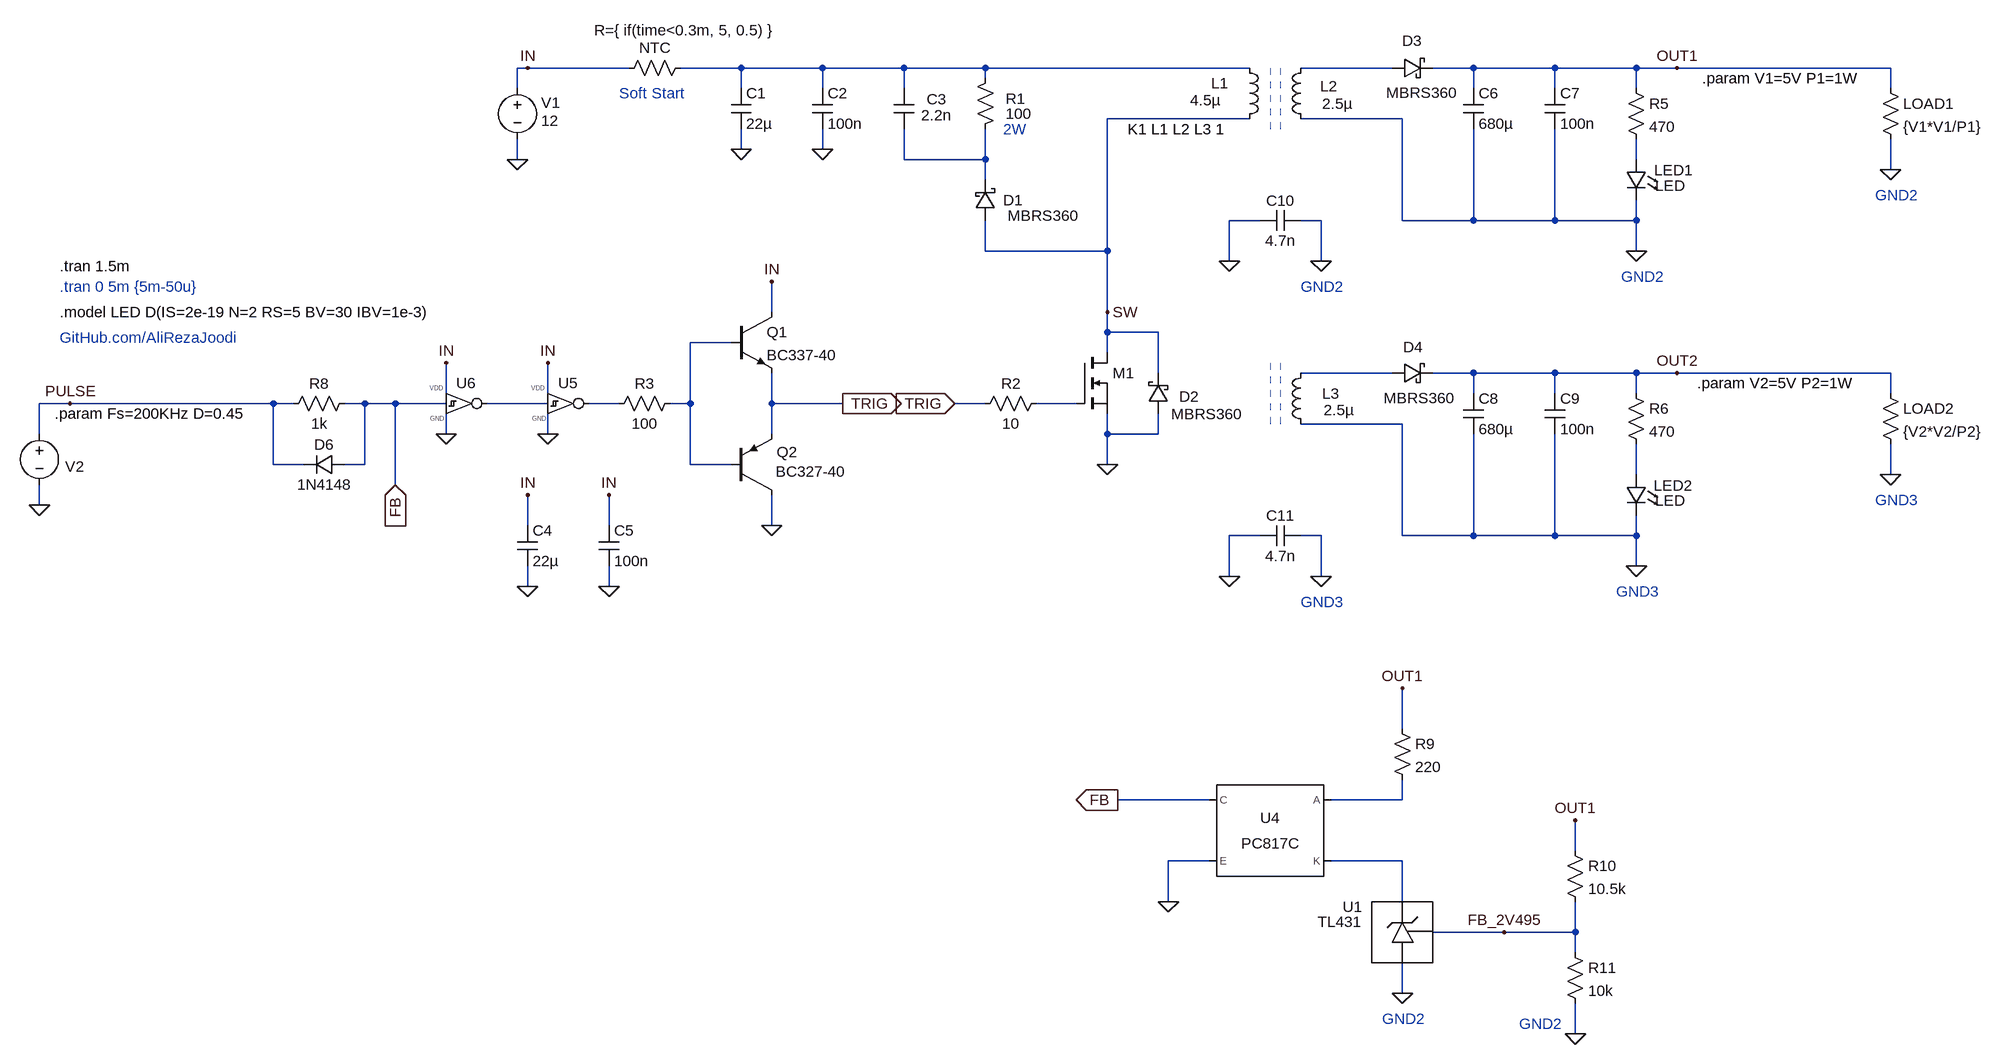
[diagram p0: schematic v2.0.asc]
v2.0.asc, the LTspice schematic file:
Version 4.1
SHEET 1 2628 1988
WIRE 304 192 288 192
WIRE 464 192 304 192
WIRE 640 192 544 192
WIRE 768 192 640 192
WIRE 896 192 768 192
WIRE 1024 192 896 192
WIRE 1440 192 1024 192
WIRE 1664 192 1520 192
WIRE 1792 192 1728 192
WIRE 1920 192 1792 192
WIRE 2048 192 1920 192
WIRE 2112 192 2048 192
WIRE 2448 192 2112 192
WIRE 1024 208 1024 192
WIRE 288 224 288 192
WIRE 640 224 640 192
WIRE 768 224 768 192
WIRE 896 224 896 192
WIRE 1792 224 1792 192
WIRE 1920 224 1920 192
WIRE 2048 224 2048 192
WIRE 2448 224 2448 192
WIRE 1440 272 1216 272
WIRE 1680 272 1520 272
WIRE 640 320 640 288
WIRE 768 320 768 288
WIRE 288 336 288 304
WIRE 896 336 896 288
WIRE 1024 336 1024 288
WIRE 1024 336 896 336
WIRE 2048 336 2048 304
WIRE 2448 352 2448 304
WIRE 1024 368 1024 336
WIRE 1456 432 1408 432
WIRE 1552 432 1520 432
WIRE 1680 432 1680 272
WIRE 1792 432 1792 288
WIRE 1792 432 1680 432
WIRE 1920 432 1920 288
WIRE 1920 432 1792 432
WIRE 2048 432 2048 400
WIRE 2048 432 1920 432
WIRE 1024 480 1024 432
WIRE 1216 480 1216 272
WIRE 1216 480 1024 480
WIRE 2048 480 2048 432
WIRE 1408 496 1408 432
WIRE 1552 496 1552 432
WIRE 688 576 688 528
WIRE 1216 576 1216 480
WIRE 1216 608 1216 576
WIRE 1296 608 1216 608
WIRE 624 624 560 624
WIRE 1216 640 1216 608
WIRE 1296 672 1296 608
WIRE 1664 672 1520 672
WIRE 1792 672 1728 672
WIRE 1920 672 1792 672
WIRE 2048 672 1920 672
WIRE 2112 672 2048 672
WIRE 2448 672 2112 672
WIRE 176 704 176 656
WIRE 336 704 336 656
WIRE 1792 704 1792 672
WIRE 1920 704 1920 672
WIRE 2048 704 2048 672
WIRE 2448 704 2448 672
WIRE -416 720 -464 720
WIRE -96 720 -416 720
WIRE -64 720 -96 720
WIRE 48 720 16 720
WIRE 96 720 48 720
WIRE 176 720 96 720
WIRE 336 720 240 720
WIRE 448 720 400 720
WIRE 560 720 560 624
WIRE 560 720 528 720
WIRE 688 720 688 672
WIRE 800 720 688 720
WIRE 1024 720 976 720
WIRE 1168 720 1104 720
WIRE 1680 752 1520 752
WIRE -464 768 -464 720
WIRE 176 768 176 736
WIRE 336 768 336 736
WIRE 688 768 688 720
WIRE 1216 768 1216 736
WIRE 1296 768 1296 736
WIRE 1296 768 1216 768
WIRE -96 816 -96 720
WIRE -48 816 -96 816
WIRE 48 816 48 720
WIRE 48 816 16 816
WIRE 560 816 560 720
WIRE 624 816 560 816
WIRE 1216 816 1216 768
WIRE 2048 832 2048 784
WIRE 2448 832 2448 784
WIRE 96 848 96 720
WIRE -464 880 -464 848
WIRE 304 912 304 864
WIRE 432 912 432 864
WIRE 688 912 688 864
WIRE 1456 928 1408 928
WIRE 1552 928 1520 928
WIRE 1680 928 1680 752
WIRE 1792 928 1792 768
WIRE 1792 928 1680 928
WIRE 1920 928 1920 768
WIRE 1920 928 1792 928
WIRE 2048 928 2048 896
WIRE 2048 928 1920 928
WIRE 2048 976 2048 928
WIRE 1408 992 1408 928
WIRE 1552 992 1552 928
WIRE 304 1008 304 976
WIRE 432 1008 432 976
WIRE 1680 1232 1680 1168
WIRE 1376 1344 1232 1344
WIRE 1680 1344 1680 1312
WIRE 1680 1344 1568 1344
WIRE 1952 1424 1952 1376
WIRE 1376 1440 1312 1440
WIRE 1680 1440 1568 1440
WIRE 1312 1504 1312 1440
WIRE 1680 1504 1680 1440
WIRE 1840 1552 1728 1552
WIRE 1952 1552 1952 1504
WIRE 1952 1552 1840 1552
WIRE 1952 1584 1952 1552
WIRE 1680 1648 1680 1600
WIRE 1952 1712 1952 1664
FLAG 288 336 0
FLAG -464 880 0
FLAG -416 720 PULSE
FLAG 1216 816 0
FLAG 640 320 0
FLAG 768 320 0
FLAG 2048 976 0
FLAG 2112 672 OUT2
FLAG 304 192 IN
FLAG 688 528 IN
FLAG 688 912 0
FLAG 176 768 0
FLAG 176 656 IN
FLAG 336 768 0
FLAG 336 656 IN
FLAG 304 864 IN
FLAG 304 1008 0
FLAG 432 1008 0
FLAG 2048 480 0
FLAG 2112 192 OUT1
FLAG 432 864 IN
FLAG 2448 832 0
FLAG 2448 352 0
FLAG 1216 576 SW
FLAG 1680 1648 0
FLAG 1952 1712 0
FLAG 1952 1376 OUT1
FLAG 1312 1504 0
FLAG 976 720 TRIG
IOPIN 976 720 In
FLAG 800 720 TRIG
IOPIN 800 720 Out
FLAG 1680 1168 OUT1
FLAG 1840 1552 FB_2V495
FLAG 1232 1344 FB
IOPIN 1232 1344 Out
FLAG 96 848 FB
IOPIN 96 848 In
FLAG 1552 496 0
FLAG 1408 496 0
FLAG 1552 992 0
FLAG 1408 992 0
SYMBOL voltage 288 208 R0
WINDOW 123 0 0 Left 0
WINDOW 39 24 105 Left 2
WINDOW 0 37 39 Left 2
WINDOW 3 37 67 Left 2
SYMATTR InstName V1
SYMATTR Value 12
SYMBOL voltage -464 752 R0
WINDOW 123 0 0 Left 0
WINDOW 39 0 0 Left 0
WINDOW 0 41 67 Left 2
WINDOW 3 -361 80 Invisible 2
SYMATTR InstName V2
SYMATTR Value PULSE(0 9 0 {0.01/Fs} {0.01/Fs} {D/Fs} {1/Fs})
SYMBOL ind 1424 176 R0
WINDOW 0 -45 40 Left 2
WINDOW 3 -78 67 Left 2
SYMATTR InstName L1
SYMATTR Value 4.5µ
SYMATTR SpiceLine Rser=0.057
SYMATTR Type ind
SYMBOL cap 880 288 M180
WINDOW 0 52 47 Left 2
WINDOW 3 43 22 Left 2
SYMATTR InstName C3
SYMATTR Value 2.2n
SYMBOL res 1008 304 M180
WINDOW 0 48 64 Left 2
WINDOW 3 48 40 Left 2
SYMATTR InstName R1
SYMATTR Value 100
SYMATTR SpiceLine pwr=2
SYMBOL nmos 1168 640 R0
WINDOW 3 56 72 Invisible 2
SYMATTR Value BSC100N06LS3
SYMATTR InstName M1
SYMBOL cap 624 224 R0
SYMATTR InstName C1
SYMATTR Value 22µ
SYMBOL schottky 1008 432 M180
WINDOW 0 44 32 Left 2
WINDOW 3 161 8 Right 2
SYMATTR InstName D1
SYMATTR Value MBRS360
SYMBOL cap 752 224 R0
SYMATTR InstName C2
SYMATTR Value 100n
SYMBOL schottky 1312 736 R180
WINDOW 0 -48 27 Left 2
WINDOW 3 -114 -1 Left 2
SYMATTR InstName D2
SYMATTR Value MBRS360
SYMBOL ind 1536 768 R180
WINDOW 0 -45 64 Left 2
WINDOW 3 -20 38 Right 2
SYMATTR InstName L3
SYMATTR Value 2.5µ
SYMATTR SpiceLine Rser=0.011
SYMATTR Type ind
SYMBOL schottky 1664 688 R270
WINDOW 0 41 33 VTop 2
WINDOW 3 -8 41 VBottom 2
SYMATTR InstName D4
SYMATTR Value MBRS360
SYMBOL cap 1776 704 R0
SYMATTR InstName C8
SYMATTR Value 680µ
SYMBOL cap 1904 704 R0
SYMATTR InstName C9
SYMATTR Value 100n
SYMBOL res 2032 688 R0
SYMATTR InstName R6
SYMATTR Value 470
SYMBOL npn 624 576 R0
SYMATTR InstName Q1
SYMATTR Value BC337-40
SYMBOL pnp 624 864 M180
WINDOW 0 72 68 Left 2
WINDOW 3 70 37 Left 2
SYMATTR InstName Q2
SYMATTR Value BC327-40
SYMBOL res 1008 736 R270
WINDOW 0 32 56 VTop 2
WINDOW 3 0 56 VBottom 2
SYMATTR InstName R2
SYMATTR Value 10
SYMBOL res 432 736 R270
WINDOW 0 32 56 VTop 2
WINDOW 3 0 56 VBottom 2
SYMATTR InstName R3
SYMATTR Value 100
SYMBOL res -80 736 R270
WINDOW 0 32 56 VTop 2
WINDOW 3 0 56 VBottom 2
SYMATTR InstName R8
SYMATTR Value 1k
SYMBOL diode 16 800 R90
WINDOW 0 0 32 VBottom 2
WINDOW 3 32 32 VTop 2
SYMATTR InstName D6
SYMATTR Value 1N4148
SYMBOL Optos\\PC817C 1472 1392 M0
SYMATTR InstName U4
SYMBOL cap 288 912 R0
SYMATTR InstName C4
SYMATTR Value 22µ
SYMBOL cap 416 912 R0
SYMATTR InstName C5
SYMATTR Value 100n
SYMBOL ind 1536 288 R180
WINDOW 0 -42 67 Left 2
WINDOW 3 -18 40 Right 2
SYMATTR InstName L2
SYMATTR Value 2.5µ
SYMATTR SpiceLine Rser=0.011
SYMATTR Type ind
SYMBOL schottky 1664 208 R270
WINDOW 0 43 31 VTop 2
WINDOW 3 -7 45 VBottom 2
SYMATTR InstName D3
SYMATTR Value MBRS360
SYMBOL cap 1776 224 R0
SYMATTR InstName C6
SYMATTR Value 680µ
SYMBOL cap 1904 224 R0
SYMATTR InstName C7
SYMATTR Value 100n
SYMBOL res 2032 208 R0
SYMATTR InstName R5
SYMATTR Value 470
SYMBOL res 448 208 R270
WINDOW 0 32 56 VTop 2
WINDOW 3 91 100 VBottom 2
SYMATTR InstName NTC
SYMATTR Value R={ if(time<0.3m, 5, 0.5) }
SYMBOL MyLib\\Digital\\CD40106B 336 688 R0
WINDOW 38 16 64 Invisible 2
SYMATTR InstName U5
SYMATTR SpiceLine vdd=12
SYMBOL MyLib\\Digital\\CD40106B 176 688 R0
WINDOW 38 16 64 Invisible 2
SYMATTR InstName U6
SYMATTR SpiceLine vdd=12
SYMBOL LED 2064 336 M0
WINDOW 0 -72 17 Left 2
WINDOW 3 -60 41 Left 2
SYMATTR InstName LED1
SYMATTR Value LED
SYMBOL LED 2064 832 M0
WINDOW 0 -71 17 Left 2
WINDOW 3 -60 41 Left 2
SYMATTR InstName LED2
SYMATTR Value LED
SYMBOL res 2432 688 R0
SYMATTR InstName LOAD2
SYMATTR Value {V2*V2/P2}
SYMBOL res 2432 208 R0
SYMATTR InstName LOAD1
SYMATTR Value {V1*V1/P1}
SYMBOL MyLib\\Regulator_Linear\\TL431 1680 1552 M0
SYMATTR InstName U1
SYMBOL res 1936 1408 R0
SYMATTR InstName R10
SYMATTR Value 10.5k
SYMBOL res 1936 1568 R0
SYMATTR InstName R11
SYMATTR Value 10k
SYMBOL res 1664 1216 R0
SYMATTR InstName R9
SYMATTR Value 220
SYMBOL cap 1520 416 R90
WINDOW 0 0 32 VBottom 2
WINDOW 3 32 32 VTop 2
SYMATTR InstName C10
SYMATTR Value 4.7n
SYMBOL cap 1520 912 R90
WINDOW 0 0 32 VBottom 2
WINDOW 3 32 32 VTop 2
SYMATTR InstName C11
SYMATTR Value 4.7n
TEXT -432 504 Left 2 !.tran 1.5m
TEXT 1248 288 Left 2 !K1 L1 L2 L3 1
TEXT -440 736 Left 2 !.param Fs=200KHz D=0.45
TEXT 448 232 Left 2 ;Soft Start
TEXT -432 576 Left 2 !.model LED D(IS=2e-19 N=2 RS=5 BV=30 IBV=1e-3)
TEXT -432 616 Left 2 ;GitHub.com/AliRezaJoodi
TEXT 1088 288 Right 2 ;2W
TEXT 2152 208 Left 2 !.param V1=5V P1=1W
TEXT 2144 688 Left 2 !.param V2=5V P2=1W
TEXT 2024 520 Left 2 ;GND2
TEXT 2424 392 Left 2 ;GND2
TEXT 2016 1016 Left 2 ;GND3
TEXT 2424 872 Left 2 ;GND3
TEXT 1520 536 Left 2 ;GND2
TEXT 1520 1032 Left 2 ;GND3
TEXT 1864 1696 Left 2 ;GND2
TEXT 1648 1688 Left 2 ;GND2
TEXT -432 536 Left 2 ;.tran 0 5m {5m-50u}
LINE Normal 1488 192 1488 288 2
LINE Normal 1472 192 1472 288 2
LINE Normal 1488 192 1488 288 2
LINE Normal 1472 192 1472 288 2
LINE Normal 1488 656 1488 752 2
LINE Normal 1472 656 1472 752 2
LINE Normal 1488 656 1488 752 2
LINE Normal 1472 656 1472 752 2

The netlist it stands for:
* v2.0.asc
V1 IN 0 12
V2 PULSE 0 PULSE(0 9 0 {0.01/Fs} {0.01/Fs} {D/Fs} {1/Fs})
L1 N001 SW 4.5µ Rser=0.057
C3 N003 N001 2.2n
R1 N003 N001 100 pwr=2
M1 SW N009 0 0 BSC100N06LS3
C1 N001 0 22µ
D1 SW N003 MBRS360
C2 N001 0 100n
D2 0 SW MBRS360
L3 0 N006 2.5µ Rser=0.011
D4 N006 OUT2 MBRS360
C8 OUT2 0 680µ
C9 OUT2 0 100n
R6 OUT2 N010 470
Q1 IN N005 TRIG 0 BC337-40
Q2 0 N005 TRIG 0 BC327-40
R2 TRIG N009 10
R3 N008 N005 100
R8 PULSE FB 1k
D6 FB PULSE 1N4148
X§U4 N011 N012 FB 0 PC817 Igain=2.3m  ; PC817C, pins A K C E
C4 IN 0 22µ
C5 IN 0 100n
L2 0 N002 2.5µ Rser=0.011
D3 N002 OUT1 MBRS360
C6 OUT1 0 680µ
C7 OUT1 0 100n
R5 OUT1 N004 470
R§NTC IN N001 R={ if(time<0.3m, 5, 0.5) }
X§U5 N007 N008 IN 0 CD40106B vdd=12 speed=2 tripdt=100n  ; pins in out VDD GND
X§U6 FB N007 IN 0 CD40106B vdd=12 speed=2 tripdt=100n  ; pins in out VDD GND
D§LED1 N004 0 LED
D§LED2 N010 0 LED
R§LOAD2 OUT2 0 {V2*V2/P2}
R§LOAD1 OUT1 0 {V1*V1/P1}
X§U1 N012 0 FB_2V495 TL431  ; pins CATHODE ANODE REF
R10 OUT1 FB_2V495 10.5k
R11 FB_2V495 0 10k
R9 OUT1 N011 220
C10 0 0 4.7n
C11 0 0 4.7n
.model D D
.lib standard.dio
.model NPN NPN
.model PNP PNP
.lib standard.bjt
.model NMOS NMOS
.model PMOS PMOS
.lib standard.mos
.tran 1.5m
K1 L1 L2 L3 1
.param Fs=200KHz D=0.45
* Soft Start
.model LED D(IS=2e-19 N=2 RS=5 BV=30 IBV=1e-3)
* GitHub.com/AliRezaJoodi
* 2W
.param V1=5V P1=1W
.param V2=5V P2=1W
* GND2
* GND2
* GND3
* GND3
* GND2
* GND3
* GND2
* GND2
* .tran 0 5m {5m-50u}
.lib PC817.sub
.lib MyLib/Digital/_CD4xxx.lib
.lib MyLib/Regulator_Linear/TL431.lib
.backanno
.end